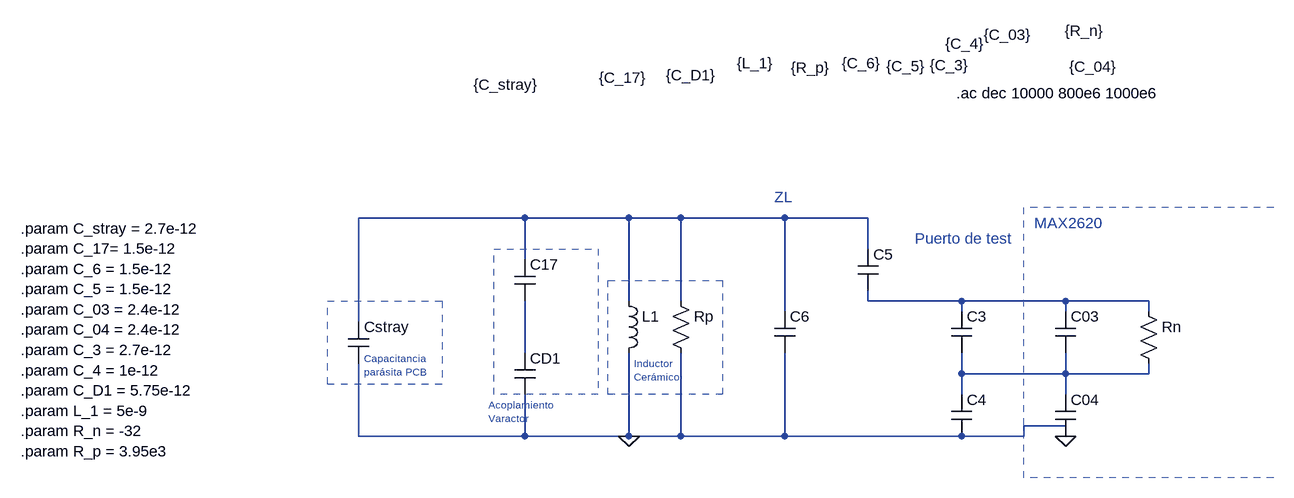
[diagram p0: schematic Modelo_eléctrico.asc]
Modelo_eléctrico.asc, the LTspice schematic file:
Version 4
SHEET 1 1536 680
WIRE 128 -32 -128 -32
WIRE 288 -32 128 -32
WIRE 368 -32 288 -32
WIRE 528 -32 368 -32
WIRE 656 -32 528 -32
WIRE 656 16 656 -32
WIRE 128 32 128 -32
WIRE 288 96 288 -32
WIRE 368 96 368 -32
WIRE 656 96 656 80
WIRE 800 96 656 96
WIRE 960 96 800 96
WIRE 1088 96 960 96
WIRE 528 112 528 -32
WIRE 800 112 800 96
WIRE 960 112 960 96
WIRE 1088 112 1088 96
WIRE -128 128 -128 -32
WIRE 128 176 128 96
WIRE 800 208 800 176
WIRE 960 208 960 176
WIRE 960 208 800 208
WIRE 1088 208 1088 192
WIRE 1088 208 960 208
WIRE 800 240 800 208
WIRE 960 240 960 208
WIRE 960 288 896 288
WIRE -128 304 -128 192
WIRE 128 304 128 240
WIRE 128 304 -128 304
WIRE 288 304 288 176
WIRE 288 304 128 304
WIRE 368 304 368 176
WIRE 368 304 288 304
WIRE 528 304 528 176
WIRE 528 304 368 304
WIRE 800 304 528 304
WIRE 896 304 896 288
WIRE 896 304 800 304
FLAG 960 304 0
FLAG 288 304 0
SYMBOL cap -144 128 R0
WINDOW 3 193 -365 Left 2
SYMATTR Value {C_stray}
SYMATTR InstName Cstray
SYMBOL cap 112 32 R0
WINDOW 3 130 -280 Left 2
SYMATTR Value {C_17}
SYMATTR InstName C17
SYMBOL cap 112 176 R0
WINDOW 3 233 -428 Left 2
SYMATTR Value {C_D1}
SYMATTR InstName CD1
SYMBOL ind 272 80 R0
WINDOW 3 182 -350 Left 2
SYMATTR Value {L_1}
SYMATTR InstName L1
SYMBOL res 352 80 R0
WINDOW 3 185 -343 Left 2
SYMATTR Value {R_p}
SYMATTR InstName Rp
SYMBOL cap 512 112 R0
WINDOW 3 104 -382 Left 2
SYMATTR Value {C_6}
SYMATTR InstName C6
SYMBOL cap 640 16 R0
WINDOW 3 44 -282 Left 2
SYMATTR Value {C_5}
SYMATTR InstName C5
SYMBOL cap 784 112 R0
WINDOW 3 -33 -379 Left 2
SYMATTR Value {C_3}
SYMATTR InstName C3
SYMBOL cap 784 240 R0
WINDOW 3 -9 -540 Left 2
SYMATTR Value {C_4}
SYMATTR InstName C4
SYMBOL cap 944 112 R0
WINDOW 3 -110 -426 Left 2
SYMATTR Value {C_03}
SYMATTR InstName C03
SYMBOL cap 944 240 R0
WINDOW 3 22 -505 Left 2
SYMATTR Value {C_04}
SYMATTR InstName C04
SYMBOL res 1072 96 R0
WINDOW 3 -113 -416 Left 2
SYMATTR Value {R_n}
SYMATTR InstName Rn
TEXT -648 -16 Left 2 !.param C_stray = 2.7e-12\n.param C_17= 1.5e-12\n.param C_6 = 1.5e-12\n.param C_5 = 1.5e-12\n.param C_03 = 2.4e-12\n.param C_04 = 2.4e-12\n.param C_3 = 2.7e-12\n.param C_4 = 1e-12\n.param C_D1 = 5.75e-12\n.param L_1 = 5e-9\n.param R_n = -32\n.param R_p = 3.95e3
TEXT 792 -224 Left 2 !.ac dec 10000 800e6 1000e6
TEXT -120 184 Left 1 ;Capacitancia\nparásita PCB
TEXT 72 256 Left 1 ;Acoplamiento\nVaractor
TEXT 296 192 Left 1 ;Inductor\nCerámico
TEXT 912 -24 Left 2 ;MAX2620
TEXT 728 0 Left 2 ;Puerto de test
TEXT 512 -64 Left 2 ;ZL
LINE Normal 896 368 896 -48 2
LINE Normal 1280 -48 896 -48 2
LINE Normal 1280 -48 1280 -48 2
LINE Normal 1280 368 896 368 2
RECTANGLE Normal 0 224 -176 96 2
RECTANGLE Normal 240 240 80 16 2
RECTANGLE Normal 432 240 256 64 2

The netlist it stands for:
* Modelo_eléctrico.asc
Cstray N001 0 {C_stray}
C17 N001 N003 {C_17}
CD1 N003 0 {C_D1}
L1 N001 0 {L_1}
Rp N001 0 {R_p}
C6 N001 0 {C_6}
C5 N001 N002 {C_5}
C3 N002 N004 {C_3}
C4 N004 0 {C_4}
C03 N002 N004 {C_03}
C04 N004 0 {C_04}
Rn N002 N004 {R_n}
.param C_stray = 2.7e-12
.param C_17= 1.5e-12
.param C_6 = 1.5e-12
.param C_5 = 1.5e-12
.param C_03 = 2.4e-12
.param C_04 = 2.4e-12
.param C_3 = 2.7e-12
.param C_4 = 1e-12
.param C_D1 = 5.75e-12
.param L_1 = 5e-9
.param R_n = -32
.param R_p = 3.95e3
.ac dec 10000 800e6 1000e6
* Capacitancia
* parásita PCB
* Acoplamiento
* Varactor
* Inductor
* Cerámico
* MAX2620
* Puerto de test
* ZL
.backanno
.end